# Altium schematic sheet 电机驱动&步进电机驱动.SchDoc
size 558 x 241 mm
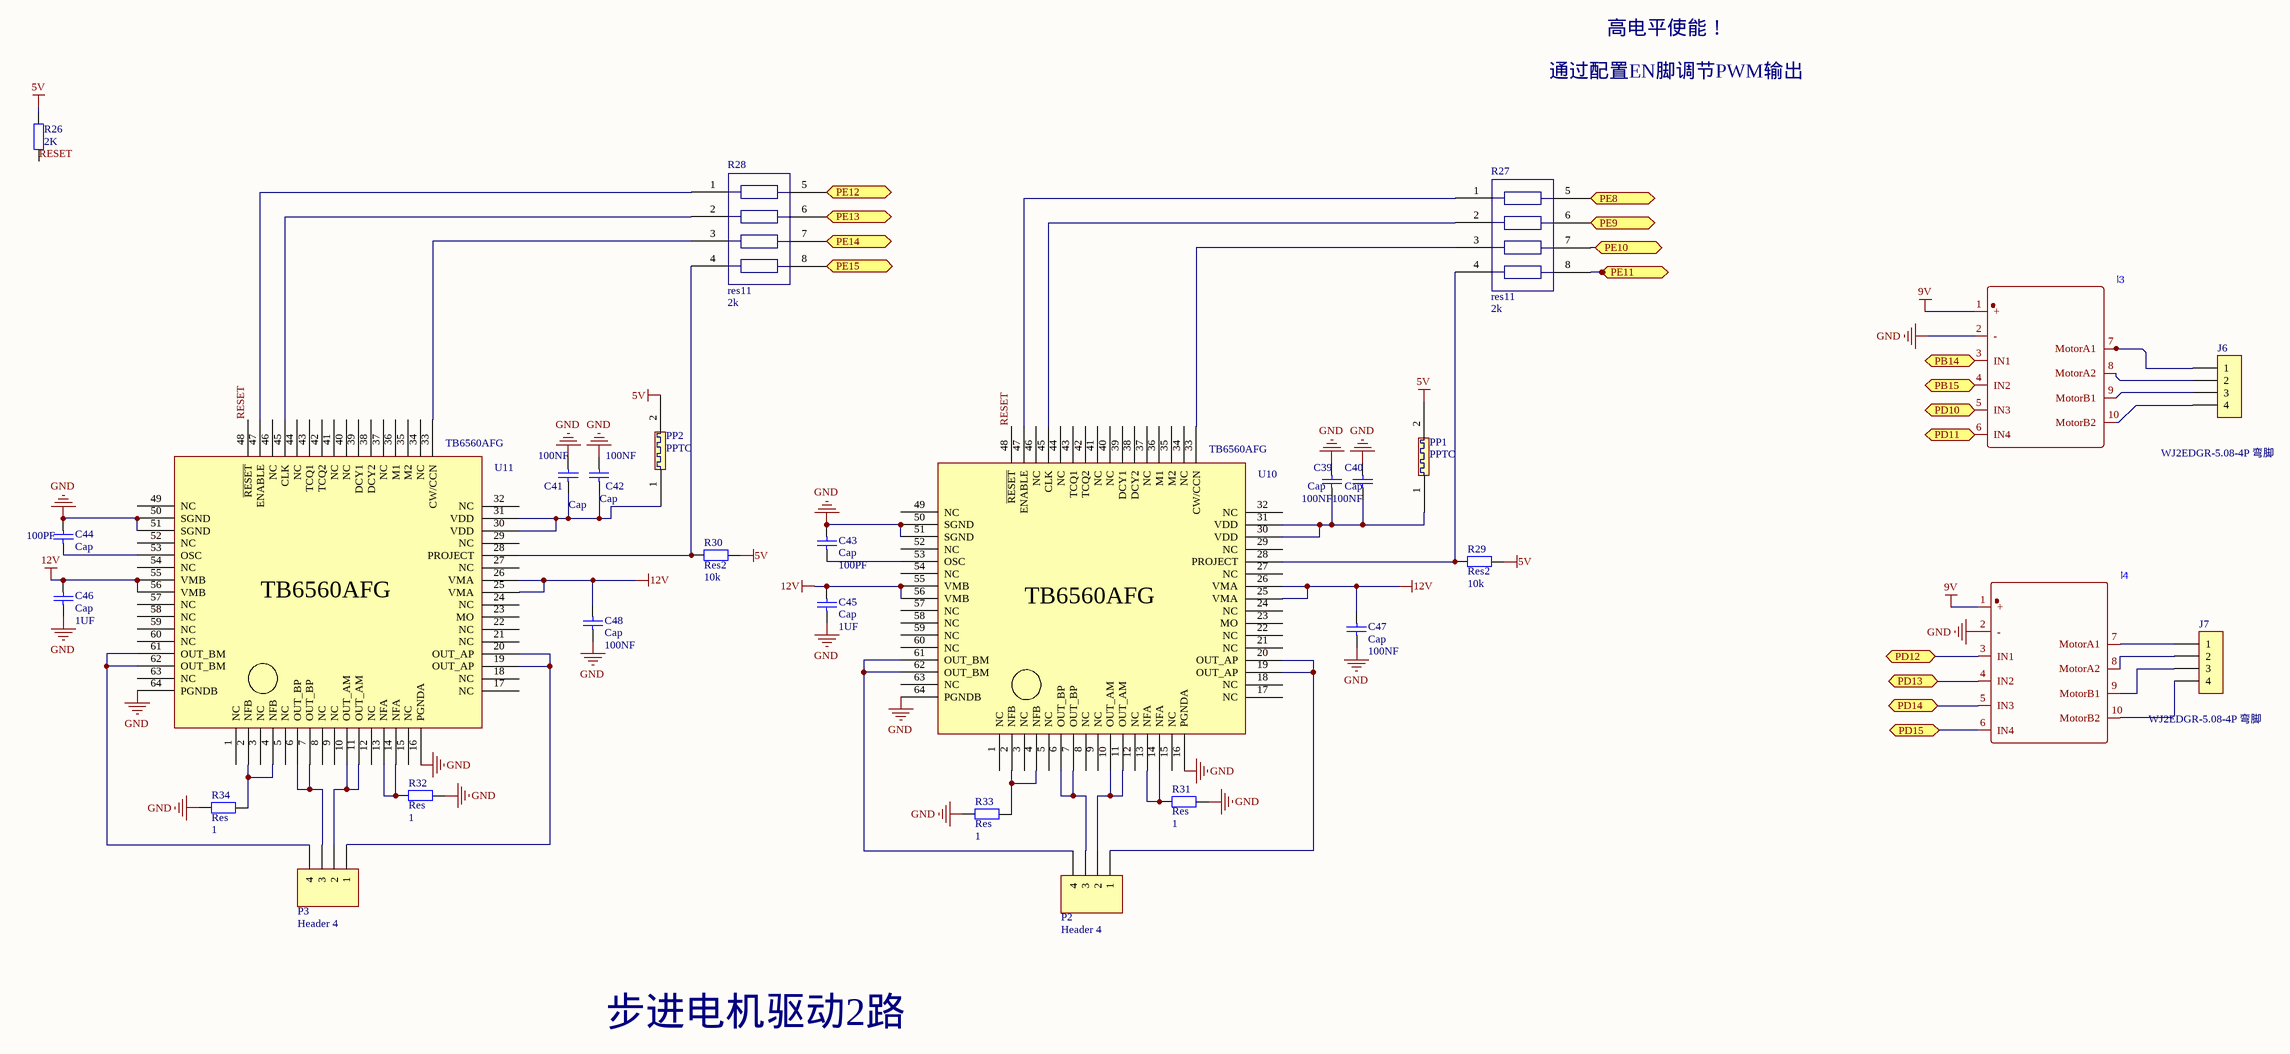
[diagram p0: 电机驱动&步进电机驱动.SchDoc]

## Parts
C39  Cap  value 100NF  [0805_C]
C40  Cap  value 100NF  [0805_C]
C41  Cap  value 100NF  [0805_C]
C42  Cap  value 100NF  [0805_C]
C43  Cap  value 100PF  [0805_C]
C44  Cap  value 100PF  [0805_C]
C45  Cap  value 1UF  [0805_C]
C46  Cap  value 1UF  [0805_C]
C47  Cap  value 100NF  [0805_C]
C48  Cap  value 100NF  [0805_C]
J6  WJ2EDGR-5.08-4P 弯脚  [WJ2EDGR-5.08-4]
J7  WJ2EDGR-5.08-4P 弯脚  [WJ2EDGR-5.08-4]
l3  (no value)  [L298N_MINI]
l4  (no value)  [L298N_MINI]
P2  Header 4  [WJ2EDGR-5.08-4]
P3  Header 4  [WJ2EDGR-5.08-4]
PP1  PPTC  [1206]
PP2  PPTC  [1206]
R26  value 2K  [0805]  (hidden comment: Res2)
R27  res11  value 2k  [RES_PACK4]
R28  res11  value 2k  [RES_PACK4]
R29  Res2  value 10k  [0805]
R30  Res2  value 10k  [0805]
R31  Res  value 1  [2512]
R32  Res  value 1  [2512]
R33  Res  value 1  [2512]
R34  Res  value 1  [2512]
U10  TB6560AFG  [TB6560AFG]
U11  TB6560AFG  [TB6560AFG]

## Ports
PB14, PB15, PD10, PD11, PD12, PD13, PD14, PD15, PE8, PE9, PE10, PE11, PE12, PE13, PE14, PE15

## Nets
5V: PP1.2(B) PP2.2(B) R26.1 R29.1 R30.1
9V: l3.1(+) l4.1(+)
12V: C45.2 C46.2 C47.1 C48.1 U10.25(VMA) U10.26(VMA) U10.55(VMB) U10.56(VMB) U11.25(VMA) U11.26(VMA) U11.55(VMB) U11.56(VMB)
GND: C39.2 C40.2 C41.2 C42.2 C43.2 C44.2 C45.1 C46.1 C47.2 C48.2 l3.2(-) l4.2(-) R31.1 R32.1 R33.2 R34.2 U10.16(PGNDA) U10.50(SGND) U10.51(SGND) U10.64(PGNDB) U11.16(PGNDA) U11.50(SGND) U11.51(SGND) U11.64(PGNDB)
PB14: l3.3(IN1) ; port PB14
PB15: l3.4(IN2) ; port PB15
PD10: l3.5(IN3) ; port PD10
PD11: l3.6(IN4) ; port PD11
PD12: l4.3(IN1) ; port PD12
PD13: l4.4(IN2) ; port PD13
PD14: l4.5(IN3) ; port PD14
PD15: l4.6(IN4) ; port PD15
PE8: R27.5(PGNDB) ; port PE8
PE9: R27.6(PGNDB) ; port PE9
PE10: R27.7(PGNDB) ; port PE10
PE11: R27.8(PGNDB) ; port PE11
PE12: R28.5(PGNDB) ; port PE12
PE13: R28.6(PGNDB) ; port PE13
PE14: R28.7(PGNDB) ; port PE14
PE15: R28.8(PGNDB) ; port PE15
RESET: R26.2 U10.48(~{RESET}) U11.48(~{RESET})
NetC39_1: C39.1 C40.1 PP1.1(B) U10.30(VDD) U10.31(VDD)
NetC41_1: C41.1 C42.1 PP2.1(B) U11.30(VDD) U11.31(VDD)
NetC43_1: C43.1 U10.53(OSC)
NetC44_1: C44.1 U11.53(OSC)
NetJ6_1: J6.1 l3.7(MotorA1)
NetJ6_2: J6.2 l3.8(MotorA2)
NetJ6_3: J6.3 l3.9(MotorB1)
NetJ6_4: J6.4 l3.10(MotorB2)
NetJ7_1: J7.1 l4.7(MotorA1)
NetJ7_2: J7.2 l4.8(MotorA2)
NetJ7_3: J7.3 l4.9(MotorB1)
NetJ7_4: J7.4 l4.10(MotorB2)
NetP2_1: P2.1 U10.19(OUT_AP) U10.20(OUT_AP)
NetP2_2: P2.2 U10.10(OUT_AM) U10.11(OUT_AM)
NetP2_3: P2.3 U10.6(OUT_BP) U10.7(OUT_BP)
NetP2_4: P2.4 U10.61(OUT_BM) U10.62(OUT_BM)
NetP3_1: P3.1 U11.19(OUT_AP) U11.20(OUT_AP)
NetP3_2: P3.2 U11.10(OUT_AM) U11.11(OUT_AM)
NetP3_3: P3.3 U11.6(OUT_BP) U11.7(OUT_BP)
NetP3_4: P3.4 U11.61(OUT_BM) U11.62(OUT_BM)
NetR27_1: R27.1(PGNDB) U10.47(ENABLE)
NetR27_2: R27.2(PGNDB) U10.45(CLK)
NetR27_3: R27.3(PGNDB) U10.33(CW/CCN)
NetR27_4: R27.4(PGNDB) R29.2 U10.28(PROJECT)
NetR28_1: R28.1(PGNDB) U11.47(ENABLE)
NetR28_2: R28.2(PGNDB) U11.45(CLK)
NetR28_3: R28.3(PGNDB) U11.33(CW/CCN)
NetR28_4: R28.4(PGNDB) R30.2 U11.28(PROJECT)
NetR31_2: R31.2 U10.13(NFA) U10.14(NFA)
NetR32_2: R32.2 U11.13(NFA) U11.14(NFA)
NetR33_1: R33.1 U10.2(NFB) U10.4(NFB)
NetR34_1: R34.1 U11.2(NFB) U11.4(NFB)

Not connected (* = marked no-connect by the designer): U10 1(NC) 3(NC) 5(NC) 8(NC) 9(NC) 12(NC) 15(NC) 17(NC) 18(NC) 21(NC) 22(NC) 23(MO) 24(NC) 27(NC) 29(NC) 32(NC) 34(NC) 35(M2) 36(M1) 37(NC) 38(DCY2) 39(DCY1) 40(NC) 41(NC) 42(TCQ2) 43(TCQ1) 44(NC) 46(NC) 49(NC) 52(NC) 54(NC) 57(NC) 58(NC) 59(NC) 60(NC) 63(NC); U11 1(NC) 3(NC) 5(NC) 8(NC) 9(NC) 12(NC) 15(NC) 17(NC) 18(NC) 21(NC) 22(NC) 23(MO) 24(NC) 27(NC) 29(NC) 32(NC) 34(NC) 35(M2) 36(M1) 37(NC) 38(DCY2) 39(DCY1) 40(NC) 41(NC) 42(TCQ2) 43(TCQ1) 44(NC) 46(NC) 49(NC) 52(NC) 54(NC) 57(NC) 58(NC) 59(NC) 60(NC) 63(NC)

## Notes on the sheet
- 高电平使能！
- 通过配置EN脚调节PWM输出
- 步进电机驱动2路

## Library data of the parts
C39-C48 = Cap: Capacitor; Published: 8-Jun-2000; LatestRevisionDate: 17-Jul-2002; LatestRevisionNote: Re-released for DXP Platform.; PackageReference: RAD-0.3; Publisher: Altium Limited; PackageDescription: Radial Cap, Thru-Hole; 2 Leads; 0.3 in Pin Spacing
J6 J7 = WJ2EDGR-5.08-4P 弯脚: 2EDG连接器; ComponentLink1URL: https://detail.tmall.com/item.htm?spm=a1z10.5-b.w4011-14865958799.85.B0p41N&id=45355509244&rn=e90e7252b5175cd006380c5c01151190&abbucket=9; price: 0.56; Supplier: Farpu; SuppliersPartNumber: *; Manufacturer: *; ComponentLink1Description: 供应商链接
l3 l4 = l298n_mini
P2 P3 = Header 4: Header, 4-Pin; LatestRevisionDate: 17-Jul-2002; LatestRevisionNote: Re-released for DXP Platform.; Publisher: Altium Limited
R26 R29-R34 = Res2: Resistor; Published: 8-Jun-2000; LatestRevisionDate: 17-Jul-2002; LatestRevisionNote: Re-released for DXP Platform.; PackageReference: AXIAL-0.4; Publisher: Altium Limited; PackageDescription: Axial Device, Thru-Hole; 2 Leads; 0.4 in Pin Spacing